# Altium project PCB_Project1.PrjPCB
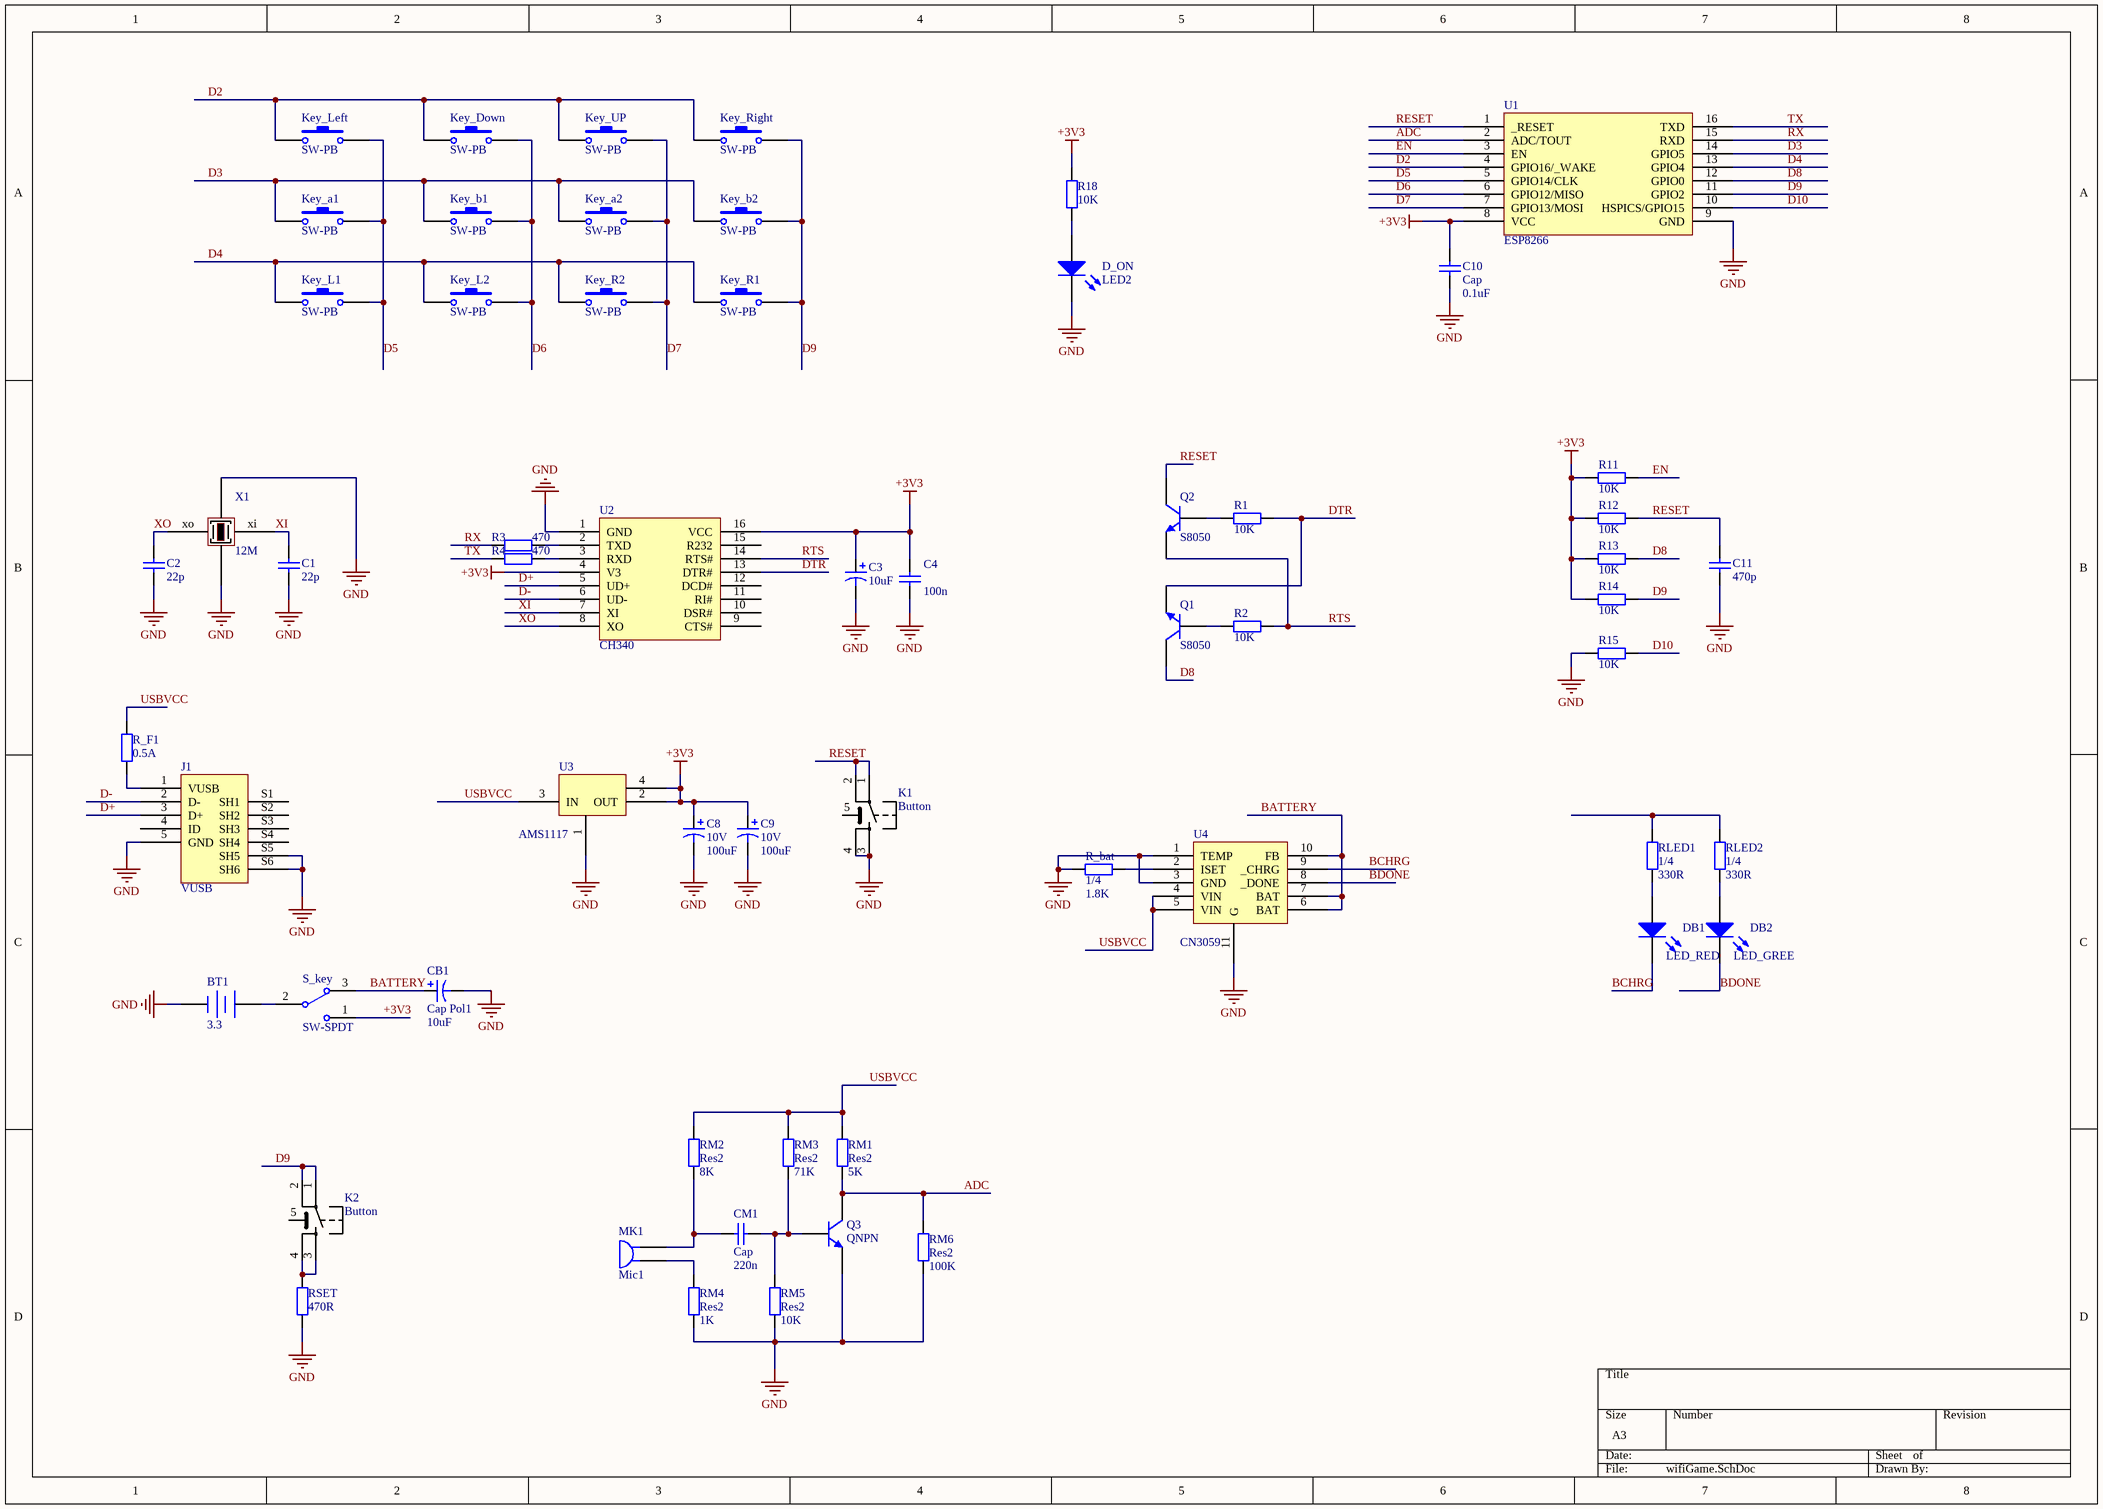
[diagram p0: wifiGame.SchDoc]
4 sheets, 161 parts. Net scope: global (net labels, ports and power ports of the same name join across sheets).
Board files: OneWifiGamePad.PcbDoc, gamePadRL.PcbDoc, gamePadRL2.PcbDoc
Sheets:
  wifiGame.SchDoc
  OneWifiGamePad.SchDoc
  OneWifiGameBAT.SchDoc
  gamePadRL.SchDoc

## Sheet wifiGame.SchDoc
size A3

### Parts
(Parts that share a designator on the sheet are numbered #1, #2 ... from top to bottom, then left to right.)
BT1#1  3.3  [BAT-2]
C1#1  22p  [RAD-0.3]
C2#1  22p  [RAD-0.3]
C3#1  10uF  [RB7.6-15]
C4#1  100n  [RAD-0.3]
C8#1  10V  value 100uF  [RB7.6-15]
C9#1  10V  value 100uF  [RB7.6-15]
C10#1  Cap  value 0.1uF  [RAD-0.3]
C11#1  470p  [RAD-0.3]
CB1#1  Cap Pol1  value 10uF  [RB7.6-15]
CM1  Cap  value 220n  [RAD-0.3]
D_ON#1  LED2  [DSO-F2/D6.1]
DB1#1  LED_RED  [DSO-F2/D6.1]
DB2#1  LED_GREE  [DSO-F2/D6.1]
J1#1  VUSB
K1  Button
K2#1  Button
Key_a1#1  SW-PB  [SPST-2]
Key_a2#1  SW-PB  [SPST-2]
Key_b1#1  SW-PB  [SPST-2]
Key_b2#1  SW-PB  [SPST-2]
Key_Down#1  SW-PB  [SPST-2]
Key_L1#1  SW-PB  [SPST-2]
Key_L2#1  SW-PB  [SPST-2]
Key_Left#1  SW-PB  [SPST-2]
Key_R1#1  SW-PB  [SPST-2]
Key_R2#1  SW-PB  [SPST-2]
Key_Right#1  SW-PB  [SPST-2]
Key_UP#1  SW-PB  [SPST-2]
MK1  Mic1  [PIN2]
Q1#1  S8050  [SOT95P240-3N]
Q2#1  S8050  [SOT95P240-3N]
Q3  QNPN  [SOT95P240-3N]
R1#1  10K  [AXIAL-0.4]
R2#1  10K  [AXIAL-0.4]
R3#1  470  [AXIAL-0.4]
R4#1  470  [AXIAL-0.4]
R11#1  10K  [AXIAL-0.4]
R12#1  10K  [AXIAL-0.4]
R13#1  10K  [AXIAL-0.4]
R14  10K  [AXIAL-0.4]
R15#1  10K  [AXIAL-0.4]
R18#1  10K  [AXIAL-0.4]
R_bat#1  1/4  value 1.8K  [AXIAL-0.4]
R_F1#1  0.5A  [AXIAL-0.4]
RLED1#1  1/4  value 330R  [AXIAL-0.4]
RLED2#1  1/4  value 330R  [AXIAL-0.4]
RM1  Res2  value 5K  [AXIAL-0.4]
RM2  Res2  value 8K  [AXIAL-0.4]
RM3  Res2  value 71K  [AXIAL-0.4]
RM4  Res2  value 1K  [AXIAL-0.4]
RM5  Res2  value 10K  [AXIAL-0.4]
RM6  Res2  value 100K  [AXIAL-0.4]
RSET#1  value 470R  [AXIAL-0.4]  (hidden comment: Res2)
S_key#1  SW-SPDT  [TL36WW15050]
U1#1  ESP8266  [ESP8266MOD?]
U2#1  CH340  [CH340]
U3#1  AMS1117
U4#1  CN3059  [CN3059]
X1#1  12M  [OSO]

### Nets
+3V3: C3#1.1 C4#1.2 C8#1.1 C9#1.1 C10#1.2 R11#1.1 R12#1.1 R13#1.1 R14.1 R18#1.1 S_key#1.1 U1#1.8(VCC) U2#1.4(V3) U2#1.16(VCC) U3#1.2(OUT) U3#1.4(p4)
GND: BT1#1.2(-) C1#1.1 C2#1.1 C3#1.2 C4#1.1 C8#1.2 C9#1.2 C10#1.1 C11#1.1 CB1#1.2 D_ON#1.2(K) J1#1.5(GND) J1#1.S5(SH5) J1#1.S6(SH6) K1.3 K1.4 Q3.3(E) R15#1.1 R_bat#1.2 RM4.1 RM5.1 RM6.1 RSET#1.1 U1#1.9(GND) U2#1.1(GND) U3#1.1(p1) U4#1.1(TEMP) U4#1.3(GND) U4#1.11(G) X1#1.g1(xo) X1#1.g2
ADC: Q3.1(C) RM1.1 RM6.2 U1#1.2(ADC/TOUT)
BATTERY: CB1#1.1 S_key#1.3 U4#1.6(BAT) U4#1.7(BAT) U4#1.10(FB)
BCHRG: DB1#1.2(K) U4#1.9(_CHRG)
BDONE: DB2#1.2(K) U4#1.8(_DONE)
D2: Key_Down#1.1 Key_Left#1.1 Key_Right#1.1 Key_UP#1.1 U1#1.4(GPIO16/_WAKE)
D3: Key_a1#1.1 Key_a2#1.1 Key_b1#1.1 Key_b2#1.1 U1#1.14(GPIO5)
D4: Key_L1#1.1 Key_L2#1.1 Key_R1#1.1 Key_R2#1.1 U1#1.13(GPIO4)
D5: Key_a1#1.2 Key_L1#1.2 Key_Left#1.2 U1#1.5(GPIO14/CLK)
D6: Key_b1#1.2 Key_Down#1.2 Key_L2#1.2 U1#1.6(GPIO12/MISO)
D7: Key_a2#1.2 Key_R2#1.2 Key_UP#1.2 U1#1.7(GPIO13/MOSI)
D8: Q1#1.1(C) R13#1.2 U1#1.12(GPIO0)
D9: K2#1.1 K2#1.2 Key_b2#1.2 Key_R1#1.2 Key_Right#1.2 R14.2 U1#1.11(GPIO2)
D10: R15#1.2 U1#1.10(HSPICS/GPIO15)
D+: J1#1.3(D+) U2#1.5(UD+)
D-: J1#1.2(D-) U2#1.6(UD-)
DTR: Q1#1.3(E) R1#1.2 U2#1.13(DTR#)
EN: R11#1.2 U1#1.3(EN)
RESET: C11#1.2 K1.1 K1.2 Q2#1.1(C) R12#1.2 U1#1.1(_RESET)
RTS: Q2#1.3(E) R2#1.2 U2#1.14(RTS#)
RX: R3#1.1 U1#1.15(RXD)
TX: R4#1.1 U1#1.16(TXD)
USBVCC: R_F1#1.2 RM1.2 RM2.2 RM3.2 U3#1.3(IN) U4#1.4(VIN) U4#1.5(VIN)
XI: C1#1.2 U2#1.7(XI) X1#1.xi(VCC)
XO: C2#1.2 U2#1.8(XO) X1#1.xo(VCC)
NetBT1#1_1: BT1#1.1(+) S_key#1.2
NetCM1_1: CM1.1 MK1.2 RM2.1
NetCM1_2: CM1.2 Q3.2(B) RM3.1 RM5.2
NetD_ON#1_1: D_ON#1.1(A) R18#1.2
NetDB1#1_1: DB1#1.1(A) RLED1#1.1
NetDB2#1_1: DB2#1.1(A) RLED2#1.1
NetJ1#1_1: J1#1.1(VUSB) R_F1#1.1
NetK2#1_3: K2#1.3 K2#1.4 RSET#1.2
NetMK1_1: MK1.1 RM4.2
NetQ1#1_2: Q1#1.2(B) R2#1.1
NetQ2#1_2: Q2#1.2(B) R1#1.1
NetR3#1_2: R3#1.2 U2#1.2(TXD)
NetR4#1_2: R4#1.2 U2#1.3(RXD)
NetR_bat#1_1: R_bat#1.1 U4#1.2(ISET)
NetRLED1#1_2: RLED1#1.2 RLED2#1.2

Not connected (* = marked no-connect by the designer): J1#1 4(ID) S1(SH1) S2(SH2) S3(SH3) S4(SH4); K1 5; K2#1 5; U2#1 9(CTS#) 10(DSR#) 11(RI#) 12(DCD#) 15(R232)

### Library data of the parts
BT1#1 = Battery: Multicell Battery; Published: 24-Mar-1999; LatestRevisionDate: 17-Jul-2002; LatestRevisionNote: Re-released for DXP Platform.; PackageReference: BAT-2; Publisher: Altium Limited
C1#1 C2#1 = Cap: Capacitor; Value: 0.01uF; Published: 8-Jun-2000; LatestRevisionDate: 17-Jul-2002; LatestRevisionNote: Re-released for DXP Platform.; PackageReference: RAD-0.3; Publisher: Altium Limited
C3#1 C8#1 C9#1 CB1#1 = Cap Pol1: Polarized Capacitor (Radial); Published: 8-Jun-2000; LatestRevisionDate: 17-Jul-2002; LatestRevisionNote: Re-released for DXP Platform.; PackageReference: RB7.6-15; Publisher: Altium Limited
  C3#1: Value: 10uF
C4#1 C11#1 = Cap: Capacitor; Value: 0.1uF; Published: 8-Jun-2000; LatestRevisionDate: 17-Jul-2002; LatestRevisionNote: Re-released for DXP Platform.; PackageReference: RAD-0.3; Publisher: Altium Limited
C10#1 CM1 = Cap: Capacitor; Published: 8-Jun-2000; LatestRevisionDate: 17-Jul-2002; LatestRevisionNote: Re-released for DXP Platform.; PackageReference: RAD-0.3; Publisher: Altium Limited
D_ON#1 DB1#1 DB2#1 = LED2: Typical RED, GREEN, YELLOW, AMBER GaAs LED; Published: 8-Jun-2000; LatestRevisionDate: 17-Jul-2002; LatestRevisionNote: Re-released for DXP Platform.; PackageVersion: Feb-2002; PackageReference: 3.2X1.6X1.1; Publisher: Altium Limited
K1 K2#1 = Button: Button key
Key_a1#1 Key_a2#1 Key_b1#1 Key_b2#1 Key_Down#1 Key_L1#1 Key_L2#1 Key_Left#1 Key_R1#1 Key_R2#1 Key_Right#1 Key_UP#1 = SW-PB: Switch; Published: 24-Mar-1999; LatestRevisionDate: 17-Jul-2002; LatestRevisionNote: Re-released for DXP Platform.; PackageReference: SPST-2; Publisher: Altium Limited
MK1 = Mic1: Microphone; Published: 24-Mar-1999; LatestRevisionDate: 17-Jul-2002; LatestRevisionNote: Re-released for DXP Platform.; PackageReference: PIN2; Publisher: Altium Limited
Q1#1 Q2#1 Q3 = QNPN: NPN Bipolar Transistor; Published: 8-Jun-2000; LatestRevisionDate: 29-May-2009; LatestRevisionNote: IPC-7351 Footprint Added.; PackageVersion: Aug-1999; PackageReference: SOT-23B; Publisher: Altium Limited; PackageDescription: 3-Pin SOT-23 Package 0.95 mm Pitch, 2.4 mm Lead Span
R1#1 R2#1 R11#1 R12#1 R13#1 R14 R15#1 R18#1 R_bat#1 RLED1#1 RLED2#1 RM1-RM6 RSET#1 = Res2: Resistor; Published: 8-Jun-2000; LatestRevisionDate: 17-Jul-2002; LatestRevisionNote: Re-released for DXP Platform.; PackageReference: AXIAL-0.4; Publisher: Altium Limited
  R1#1 R2#1 R11#1 R12#1 R13#1 R14 R15#1 R18#1: Value: 10K
R3#1 R4#1 R_F1#1 = Res2: Resistor; Value: 1K; Published: 8-Jun-2000; LatestRevisionDate: 17-Jul-2002; LatestRevisionNote: Re-released for DXP Platform.; PackageReference: AXIAL-0.4; Publisher: Altium Limited
S_key#1 = SW-SPDT: SPDT Subminiature Toggle Switch, Right Angle Mounting, Vertical Actuation; Published: 24-Mar-1999; LatestRevisionDate: 17-Dec-2003; LatestRevisionNote: Schematic revised, PCB Footprint replaced.; DatasheetVersion: 05-Dec-2000; PackageReference: TL36WW15050; Publisher: Altium Limited; ComponentLink1Description: Manufacturer Link; ComponentLink1URL: http://www.apem.com
U1#1 = ESP8266: MCU
U2#1 = RS232
X1#1 = oso

## Sheet OneWifiGamePad.SchDoc
size A4; PageSetup: Record=PageOptions|CenterHorizontal=True|CenterVertical=True|PrintScale=0.71|XCorrection=1.00|YCorrection=1.00|PrintKind=1|BorderSize=5000000|LeftOffset=0|BottomOffset=0|Orientation=2|PaperLength=1000|PaperWidth=1000|Scale=100|PaperSource=15|PrintQuality=600|MediaType=1|DitherType=10|PaperKind=Statement|PrintScaleMode=1
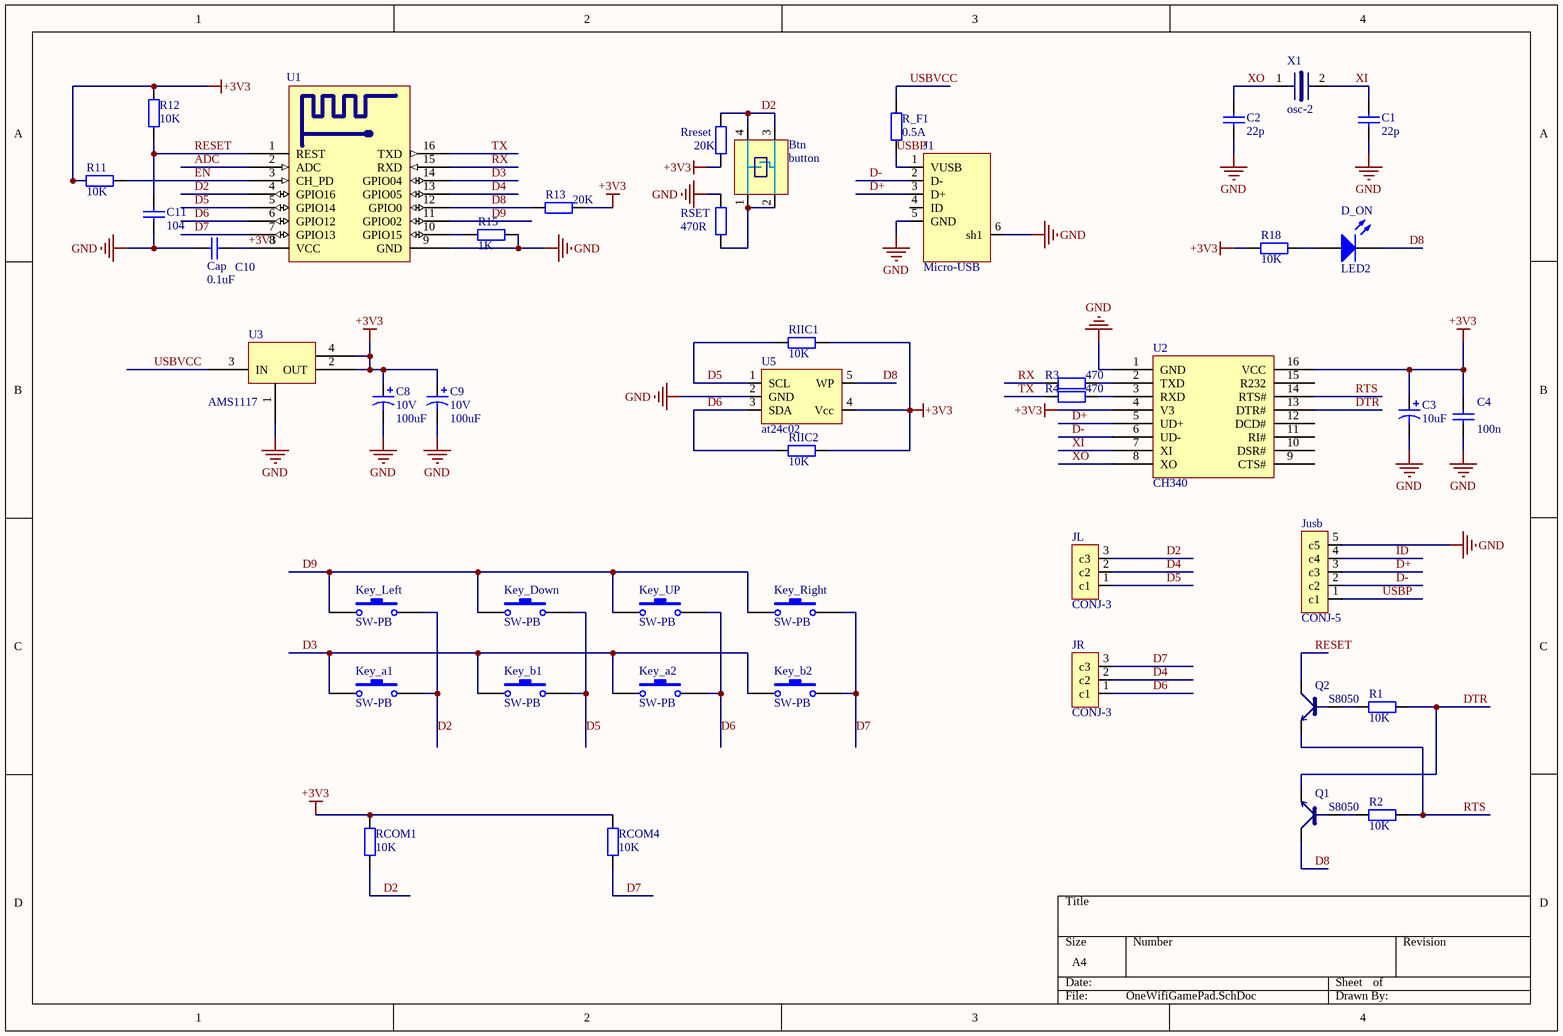
[diagram p1: OneWifiGamePad.SchDoc]

### Parts
(Parts that share a designator on the sheet are numbered #1, #2 ... from top to bottom, then left to right.)
Btn  button  [SW_6x6]
C1#2  22p  [0603]
C2#2  22p  [0603]
C3#2  10uF  [smd-ec-f5]
C4#2  100n  [0603]
C8#2  10V  value 100uF  [smd-ec-f5]
C9#2  10V  value 100uF  [smd-ec-f5]
C10#2  Cap  value 0.1uF  [0603]
C11#2  104  [0603]
D_ON#2  LED2  [0603]
J1#2  Micro-USB  [Micro_USB_B]
JL  CONJ-3  [sip-3]
JR  CONJ-3  [sip-3]
Jusb  CONJ-5  [sip-5]
Key_a1#2  SW-PB  [gamepad]
Key_a2#2  SW-PB  [gamepad]
Key_b1#2  SW-PB  [gamepad]
Key_b2#2  SW-PB  [gamepad]
Key_Down#2  SW-PB  [gamepad]
Key_Left#2  SW-PB  [GamePad]
Key_Right#2  SW-PB  [gamepad]
Key_UP#2  SW-PB  [gamepad]
Q1#2  S8050  [sot23-3]
Q2#2  S8050  [sot23-3]
R1#2  10K  [0603]
R2#2  10K  [0603]
R3#2  470  [0603]
R4#2  470  [0603]
R11#2  10K  [0603]
R12#2  10K  [0603]
R13#2  20K  [0603]
R15#2  1K  [0603]
R18#2  10K  [0603]
R_F1#2  0.5A  [0805]
RCOM1  value 10K  [0603]  (hidden comment: Res2)
RCOM4  value 10K  [0603]  (hidden comment: Res2)
RIIC1#1  10k  [0603]
RIIC2#1  10k  [0603]
Rreset#1  value 20K  [0603]  (hidden comment: 10k)
RSET#2  value 470R  [0603]  (hidden comment: Res2)
U1#2  ESP-12  [ESP_12]  (value not drawn)
U2#2  CH340  [SOP127P762-16M]
U3#2  AMS1117  [SOT-223]
U5#1  at24c02  [sot-23-5]
X1#2  osc-2  [RAD-0.2]

### Nets
+3V3: C3#2.1 C4#2.2 C8#2.1 C9#2.1 C10#2.1 R11#2.1 R12#2.2 R13#2.2 R18#2.1 RCOM1.2 RCOM4.2 RIIC1#1.1 RIIC2#1.1 Rreset#1.1 U1#2.8(VCC) U2#2.4(V3) U2#2.16(VCC) U3#2.2(OUT) U3#2.4(p4) U5#1.4(Vcc)
GND: C1#2.1 C2#2.1 C3#2.2 C4#2.1 C8#2.2 C9#2.2 C10#2.2 C11#2.1 J1#2.5(GND) J1#2.6(sh1) Jusb.5(c5) R15#2.2 RSET#2.2 U1#2.9(GND) U2#2.1(GND) U3#2.1(p1) U5#1.2(GND)
ADC: U1#2.2(ADC)
D2: Btn.3(b2) Btn.4(a2) JL.3(c3) Key_a1#2.2 Key_Left#2.2 RCOM1.1 Rreset#1.2 U1#2.4(GPIO16)
D3: Key_a1#2.1 Key_a2#2.1 Key_b1#2.1 Key_b2#2.1 U1#2.14(GPIO04)
D4: JL.2(c2) JR.2(c2) U1#2.13(GPIO05)
D5: JL.1(c1) Key_b1#2.2 Key_Down#2.2 RIIC1#1.2 U1#2.5(GPIO14) U5#1.1(SCL)
D6: JR.1(c1) Key_a2#2.2 Key_UP#2.2 RIIC2#1.2 U1#2.6(GPIO12) U5#1.3(SDA)
D7: JR.3(c3) Key_b2#2.2 Key_Right#2.2 RCOM4.1 U1#2.7(GPIO13)
D8: D_ON#2.2(K) Q1#2.3 R13#2.1 U1#2.12(GPIO0) U5#1.5(WP)
D9: Key_Down#2.1 Key_Left#2.1 Key_Right#2.1 Key_UP#2.1 U1#2.11(GPIO02)
D+: J1#2.3(D+) Jusb.3(c3) U2#2.5(UD+)
D-: J1#2.2(D-) Jusb.2(c2) U2#2.6(UD-)
DTR: Q1#2.2 R1#2.2 U2#2.13(DTR#)
EN: R11#2.2 U1#2.3(CH_PD)
ID: Jusb.4(c4)
RESET: C11#2.2 Q2#2.3 R12#2.1 U1#2.1(REST)
RTS: Q2#2.2 R2#2.2 U2#2.14(RTS#)
RX: R3#2.1 U1#2.15(RXD)
TX: R4#2.1 U1#2.16(TXD)
USBP: J1#2.1(VUSB) Jusb.1(c1) R_F1#2.1
USBVCC: R_F1#2.2 U3#2.3(IN)
XI: C1#2.2 U2#2.7(XI) X1#2.2(c7)
XO: C2#2.2 U2#2.8(XO) X1#2.1(c6)
NetBtn_1: Btn.1(a1) Btn.2(b1) RSET#2.1
NetD_ON#2_1: D_ON#2.1(A) R18#2.2
NetQ1#2_1: Q1#2.1 R2#2.1
NetQ2#2_1: Q2#2.1 R1#2.1
NetR3#2_2: R3#2.2 U2#2.2(TXD)
NetR4#2_2: R4#2.2 U2#2.3(RXD)
NetR15#2_1: R15#2.1 U1#2.10(GPIO15)

Not connected (* = marked no-connect by the designer): J1#2 4(ID); U2#2 9(CTS#) 10(DSR#) 11(RI#) 12(DCD#) 15(R232)

### Library data of the parts
C1#2 C2#2 = Cap: Capacitor; Value: 0.01uF; Published: 8-Jun-2000; LatestRevisionDate: 17-Jul-2002; LatestRevisionNote: Re-released for DXP Platform.; PackageReference: RAD-0.3; Publisher: Altium Limited
C3#2 C8#2 C9#2 = Cap Pol1: Polarized Capacitor (Radial); Published: 8-Jun-2000; LatestRevisionDate: 17-Jul-2002; LatestRevisionNote: Re-released for DXP Platform.; PackageReference: RB7.6-15; Publisher: Altium Limited
  C3#2: Value: 10uF
C4#2 C11#2 = Cap: Capacitor; Value: 0.1uF; Published: 8-Jun-2000; LatestRevisionDate: 17-Jul-2002; LatestRevisionNote: Re-released for DXP Platform.; PackageReference: RAD-0.3; Publisher: Altium Limited
C10#2 = Cap: Capacitor; Published: 8-Jun-2000; LatestRevisionDate: 17-Jul-2002; LatestRevisionNote: Re-released for DXP Platform.; PackageReference: RAD-0.3; Publisher: Altium Limited
D_ON#2 = LED2: as D_ON#1 on sheet wifiGame; Published: 8-Jun-2000; LatestRevisionDate: 17-Jul-2002; LatestRevisionNote: Re-released for DXP Platform.; PackageVersion: Feb-2002; PackageReference: 3.2X1.6X1.1; Publisher: Altium Limited
Key_a1#2 Key_a2#2 Key_b1#2 Key_b2#2 Key_Down#2 Key_Left#2 Key_Right#2 Key_UP#2 = SW-PB: Switch; Published: 24-Mar-1999; LatestRevisionDate: 17-Jul-2002; LatestRevisionNote: Re-released for DXP Platform.; PackageReference: SPST-2; Publisher: Altium Limited
Q1#2 Q2#2 = NPN_23-3
R1#2 R2#2 R11#2 R12#2 R18#2 RCOM1 RCOM4 RIIC1#1 RIIC2#1 Rreset#1 RSET#2 = Res2: Resistor; Published: 8-Jun-2000; LatestRevisionDate: 17-Jul-2002; LatestRevisionNote: Re-released for DXP Platform.; PackageReference: AXIAL-0.4; Publisher: Altium Limited
  R1#2 R2#2 R11#2 R12#2 R18#2 RIIC1#1 RIIC2#1: Value: 10K
R3#2 R4#2 R_F1#2 = Res2: Resistor; Value: 1K; Published: 8-Jun-2000; LatestRevisionDate: 17-Jul-2002; LatestRevisionNote: Re-released for DXP Platform.; PackageReference: AXIAL-0.4; Publisher: Altium Limited
R13#2 R15#2 = Res2: Resistor; Value: 10K; Published: 8-Jun-2000; LatestRevisionDate: 17-Jul-2002; LatestRevisionNote: Re-released for DXP Platform.; PackageReference: AXIAL-0.4; Publisher: Altium Limited
U2#2 = RS232

## Sheet OneWifiGameBAT.SchDoc
size A3
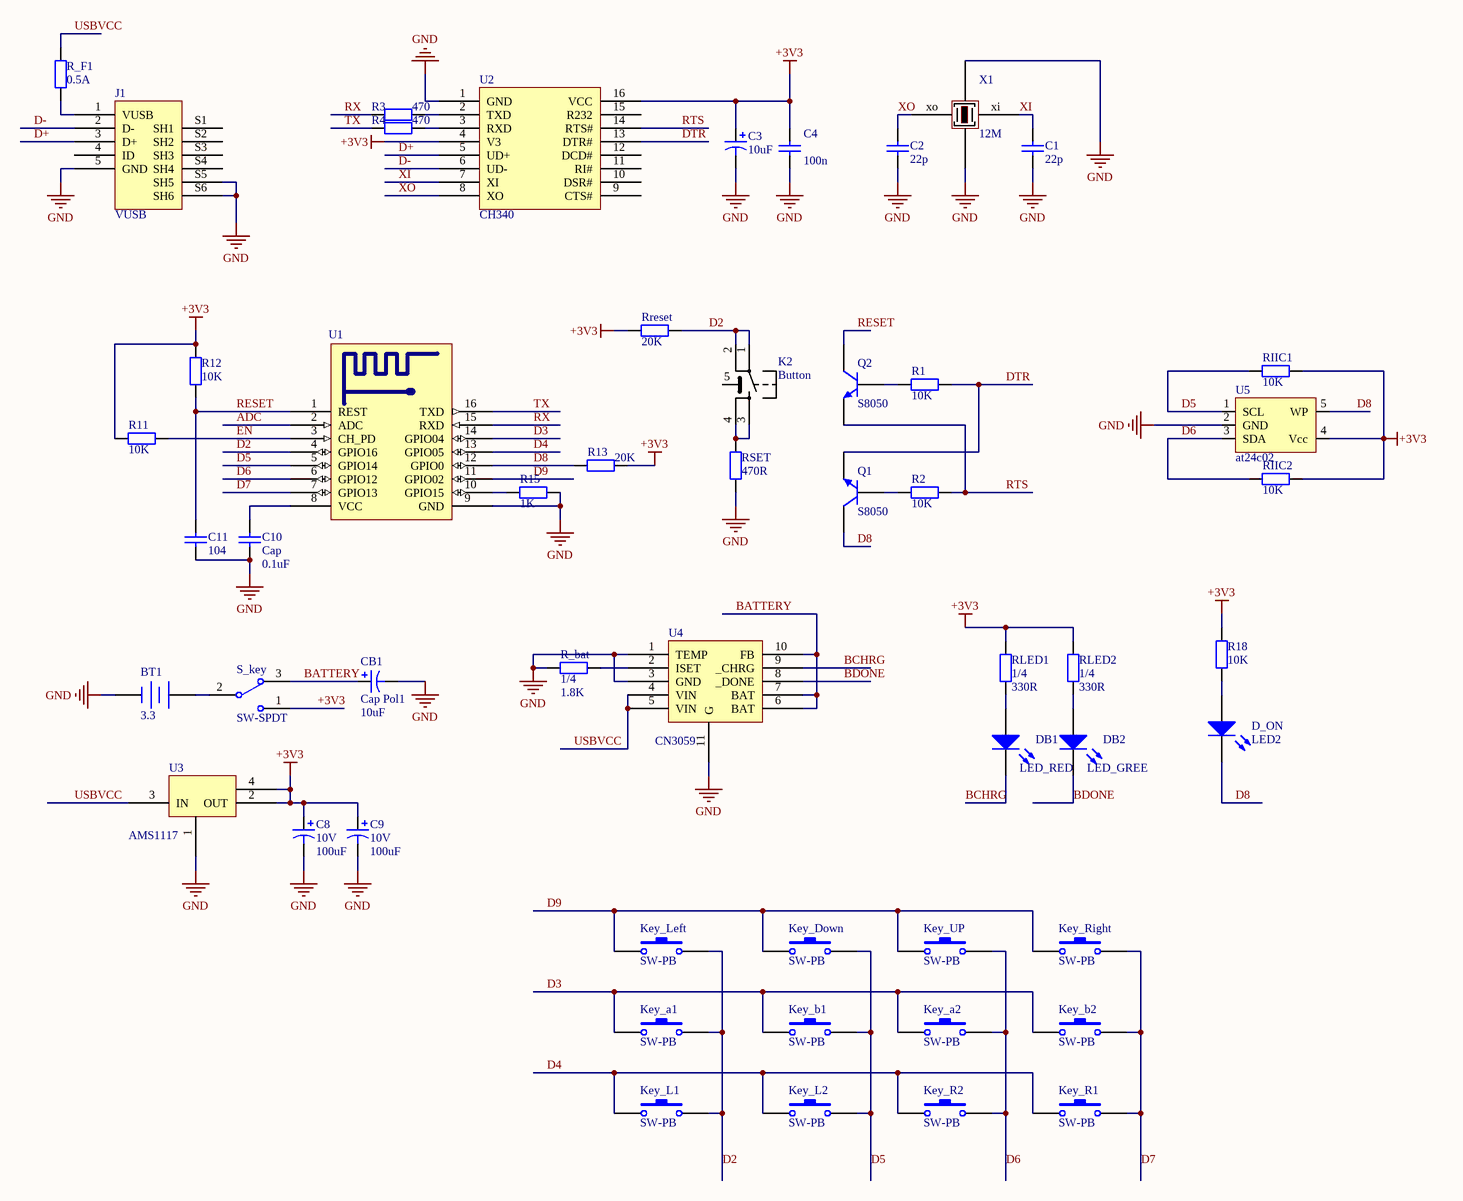
[diagram p2: OneWifiGameBAT.SchDoc]

### Parts
(Parts that share a designator on the sheet are numbered #1, #2 ... from top to bottom, then left to right.)
BT1#2  3.3  [BAT-2]
C1#3  22p  [RAD-0.3]
C2#3  22p  [RAD-0.3]
C3#3  10uF  [RB7.6-15]
C4#3  100n  [RAD-0.3]
C8#3  10V  value 100uF  [RB7.6-15]
C9#3  10V  value 100uF  [RB7.6-15]
C10#3  Cap  value 0.1uF  [RAD-0.3]
C11#3  104  [RAD-0.3]
CB1#2  Cap Pol1  value 10uF  [RB7.6-15]
D_ON#3  LED2  [DSO-F2/D6.1]
DB1#2  LED_RED  [DSO-F2/D6.1]
DB2#2  LED_GREE  [DSO-F2/D6.1]
J1#3  VUSB
K2#2  Button
Key_a1#3  SW-PB  [SPST-2]
Key_a2#3  SW-PB  [SPST-2]
Key_b1#3  SW-PB  [SPST-2]
Key_b2#3  SW-PB  [SPST-2]
Key_Down#3  SW-PB  [SPST-2]
Key_L1#2  SW-PB  [SPST-2]
Key_L2#2  SW-PB  [SPST-2]
Key_Left#3  SW-PB  [SPST-2]
Key_R1#2  SW-PB  [SPST-2]
Key_R2#2  SW-PB  [SPST-2]
Key_Right#3  SW-PB  [SPST-2]
Key_UP#3  SW-PB  [SPST-2]
Q1#3  S8050  [SOT95P240-3N]
Q2#3  S8050  [SOT95P240-3N]
R1#3  10K  [AXIAL-0.4]
R2#3  10K  [AXIAL-0.4]
R3#3  470  [AXIAL-0.4]
R4#3  470  [AXIAL-0.4]
R11#3  10K  [AXIAL-0.4]
R12#3  10K  [AXIAL-0.4]
R13#3  20K  [AXIAL-0.4]
R15#3  1K  [AXIAL-0.4]
R18#3  10K  [AXIAL-0.4]
R_bat#2  1/4  value 1.8K  [AXIAL-0.4]
R_F1#3  0.5A  [AXIAL-0.4]
RIIC1#2  10k  [AXIAL-0.4]
RIIC2#2  10k  [AXIAL-0.4]
RLED1#2  1/4  value 330R  [AXIAL-0.4]
RLED2#2  1/4  value 330R  [AXIAL-0.4]
Rreset#2  value 20K  [AXIAL-0.4]  (hidden comment: 10k)
RSET#3  value 470R  [AXIAL-0.4]  (hidden comment: Res2)
S_key#2  SW-SPDT  [TL36WW15050]
U1#3  ESP-12  (value not drawn)
U2#3  CH340  [CH340]
U3#3  AMS1117
U4#2  CN3059  [CN3059]
U5#2  at24c02
X1#3  12M  [OSO]

### Nets
+3V3: C3#3.1 C4#3.2 C8#3.1 C9#3.1 R11#3.1 R12#3.2 R13#3.2 R18#3.1 RIIC1#2.1 RIIC2#2.1 RLED1#2.2 RLED2#2.2 Rreset#2.1 S_key#2.1 U2#3.4(V3) U2#3.16(VCC) U3#3.2(OUT) U3#3.4(p4) U5#2.4(Vcc)
GND: BT1#2.2(-) C1#3.1 C2#3.1 C3#3.2 C4#3.1 C8#3.2 C9#3.2 C10#3.1 C11#3.1 CB1#2.2 J1#3.5(GND) J1#3.S5(SH5) J1#3.S6(SH6) R15#3.2 R_bat#2.2 RSET#3.1 U1#3.9(GND) U2#3.1(GND) U3#3.1(p1) U4#2.1(TEMP) U4#2.3(GND) U4#2.11(G) U5#2.2(GND) X1#3.g1(xo) X1#3.g2
ADC: U1#3.2(ADC)
BATTERY: CB1#2.1 S_key#2.3 U4#2.6(BAT) U4#2.7(BAT) U4#2.10(FB)
BCHRG: DB1#2.2(K) U4#2.9(_CHRG)
BDONE: DB2#2.2(K) U4#2.8(_DONE)
D2: K2#2.1 K2#2.2 Key_a1#3.2 Key_L1#2.2 Key_Left#3.2 Rreset#2.2 U1#3.4(GPIO16)
D3: Key_a1#3.1 Key_a2#3.1 Key_b1#3.1 Key_b2#3.1 U1#3.14(GPIO04)
D4: Key_L1#2.1 Key_L2#2.1 Key_R1#2.1 Key_R2#2.1 U1#3.13(GPIO05)
D5: Key_b1#3.2 Key_Down#3.2 Key_L2#2.2 RIIC1#2.2 U1#3.5(GPIO14) U5#2.1(SCL)
D6: Key_a2#3.2 Key_R2#2.2 Key_UP#3.2 RIIC2#2.2 U1#3.6(GPIO12) U5#2.3(SDA)
D7: Key_b2#3.2 Key_R1#2.2 Key_Right#3.2 U1#3.7(GPIO13)
D8: D_ON#3.2(K) Q1#3.1(C) R13#3.1 U1#3.12(GPIO0) U5#2.5(WP)
D9: Key_Down#3.1 Key_Left#3.1 Key_Right#3.1 Key_UP#3.1 U1#3.11(GPIO02)
D+: J1#3.3(D+) U2#3.5(UD+)
D-: J1#3.2(D-) U2#3.6(UD-)
DTR: Q1#3.3(E) R1#3.2 U2#3.13(DTR#)
EN: R11#3.2 U1#3.3(CH_PD)
RESET: C11#3.2 Q2#3.1(C) R12#3.1 U1#3.1(REST)
RTS: Q2#3.3(E) R2#3.2 U2#3.14(RTS#)
RX: R3#3.1 U1#3.15(RXD)
TX: R4#3.1 U1#3.16(TXD)
USBVCC: R_F1#3.2 U3#3.3(IN) U4#2.4(VIN) U4#2.5(VIN)
XI: C1#3.2 U2#3.7(XI) X1#3.xi(VCC)
XO: C2#3.2 U2#3.8(XO) X1#3.xo(VCC)
NetBT1#2_1: BT1#2.1(+) S_key#2.2
NetC10#3_2: C10#3.2 U1#3.8(VCC)
NetD_ON#3_1: D_ON#3.1(A) R18#3.2
NetDB1#2_1: DB1#2.1(A) RLED1#2.1
NetDB2#2_1: DB2#2.1(A) RLED2#2.1
NetJ1#3_1: J1#3.1(VUSB) R_F1#3.1
NetK2#2_3: K2#2.3 K2#2.4 RSET#3.2
NetQ1#3_2: Q1#3.2(B) R2#3.1
NetQ2#3_2: Q2#3.2(B) R1#3.1
NetR3#3_2: R3#3.2 U2#3.2(TXD)
NetR4#3_2: R4#3.2 U2#3.3(RXD)
NetR15#3_1: R15#3.1 U1#3.10(GPIO15)
NetR_bat#2_1: R_bat#2.1 U4#2.2(ISET)

Not connected (* = marked no-connect by the designer): J1#3 4(ID) S1(SH1) S2(SH2) S3(SH3) S4(SH4); K2#2 5; U2#3 9(CTS#) 10(DSR#) 11(RI#) 12(DCD#) 15(R232)

### Library data of the parts
BT1#2 = Battery: Multicell Battery; Published: 24-Mar-1999; LatestRevisionDate: 17-Jul-2002; LatestRevisionNote: Re-released for DXP Platform.; PackageReference: BAT-2; Publisher: Altium Limited
C1#3 C2#3 = Cap: Capacitor; Value: 0.01uF; Published: 8-Jun-2000; LatestRevisionDate: 17-Jul-2002; LatestRevisionNote: Re-released for DXP Platform.; PackageReference: RAD-0.3; Publisher: Altium Limited
C3#3 C8#3 C9#3 CB1#2 = Cap Pol1: Polarized Capacitor (Radial); Published: 8-Jun-2000; LatestRevisionDate: 17-Jul-2002; LatestRevisionNote: Re-released for DXP Platform.; PackageReference: RB7.6-15; Publisher: Altium Limited
  C3#3: Value: 10uF
C4#3 C11#3 = Cap: Capacitor; Value: 0.1uF; Published: 8-Jun-2000; LatestRevisionDate: 17-Jul-2002; LatestRevisionNote: Re-released for DXP Platform.; PackageReference: RAD-0.3; Publisher: Altium Limited
C10#3 = Cap: Capacitor; Published: 8-Jun-2000; LatestRevisionDate: 17-Jul-2002; LatestRevisionNote: Re-released for DXP Platform.; PackageReference: RAD-0.3; Publisher: Altium Limited
D_ON#3 DB1#2 DB2#2 = LED2: as D_ON#1 on sheet wifiGame; Published: 8-Jun-2000; LatestRevisionDate: 17-Jul-2002; LatestRevisionNote: Re-released for DXP Platform.; PackageVersion: Feb-2002; PackageReference: 3.2X1.6X1.1; Publisher: Altium Limited
K2#2 = Button: Button key
Key_a1#3 Key_a2#3 Key_b1#3 Key_b2#3 Key_Down#3 Key_L1#2 Key_L2#2 Key_Left#3 Key_R1#2 Key_R2#2 Key_Right#3 Key_UP#3 = SW-PB: Switch; Published: 24-Mar-1999; LatestRevisionDate: 17-Jul-2002; LatestRevisionNote: Re-released for DXP Platform.; PackageReference: SPST-2; Publisher: Altium Limited
Q1#3 Q2#3 = QNPN: NPN Bipolar Transistor; Published: 8-Jun-2000; LatestRevisionDate: 29-May-2009; LatestRevisionNote: IPC-7351 Footprint Added.; PackageVersion: Aug-1999; PackageReference: SOT-23B; Publisher: Altium Limited; PackageDescription: 3-Pin SOT-23 Package 0.95 mm Pitch, 2.4 mm Lead Span
R1#3 R2#3 R11#3 R12#3 R18#3 R_bat#2 RIIC1#2 RIIC2#2 RLED1#2 RLED2#2 Rreset#2 RSET#3 = Res2: Resistor; Published: 8-Jun-2000; LatestRevisionDate: 17-Jul-2002; LatestRevisionNote: Re-released for DXP Platform.; PackageReference: AXIAL-0.4; Publisher: Altium Limited
  R1#3 R2#3 R11#3 R12#3 R18#3 RIIC1#2 RIIC2#2: Value: 10K
R3#3 R4#3 R_F1#3 = Res2: Resistor; Value: 1K; Published: 8-Jun-2000; LatestRevisionDate: 17-Jul-2002; LatestRevisionNote: Re-released for DXP Platform.; PackageReference: AXIAL-0.4; Publisher: Altium Limited
R13#3 R15#3 = Res2: Resistor; Value: 10K; Published: 8-Jun-2000; LatestRevisionDate: 17-Jul-2002; LatestRevisionNote: Re-released for DXP Platform.; PackageReference: AXIAL-0.4; Publisher: Altium Limited
S_key#2 = SW-SPDT: as S_key#1 on sheet wifiGame; Published: 24-Mar-1999; LatestRevisionDate: 17-Dec-2003; LatestRevisionNote: Schematic revised, PCB Footprint replaced.; DatasheetVersion: 05-Dec-2000; PackageReference: TL36WW15050; Publisher: Altium Limited; ComponentLink1Description: Manufacturer Link; ComponentLink1URL: http://www.apem.com
U2#3 = RS232
X1#3 = oso

## Sheet gamePadRL.SchDoc
size A4
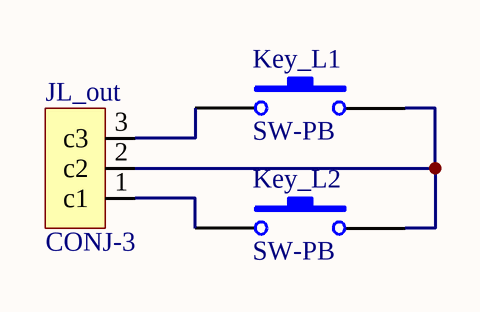
[diagram p3: gamePadRL.SchDoc]

### Parts
(Parts that share a designator on the sheet are numbered #1, #2 ... from top to bottom, then left to right.)
JL_out  CONJ-3  [sip-3]
Key_L1#3  SW-PB  [gamepadbig]
Key_L2#3  SW-PB  [gamepadbig]

### Nets
NetJL_out_1: JL_out.1(c1) Key_L2#3.1
NetJL_out_2: JL_out.2(c2) Key_L1#3.2 Key_L2#3.2
NetJL_out_3: JL_out.3(c3) Key_L1#3.1

### Library data of the parts
Key_L1#3 Key_L2#3 = SW-PB: Switch; Published: 24-Mar-1999; LatestRevisionDate: 17-Jul-2002; LatestRevisionNote: Re-released for DXP Platform.; PackageReference: SPST-2; Publisher: Altium Limited

## Nets that join several sheets
+3V3: wifiGame (16 pins), OneWifiGamePad (20 pins), OneWifiGameBAT (19 pins)
GND: wifiGame (31 pins), OneWifiGamePad (17 pins), OneWifiGameBAT (25 pins)
ADC: wifiGame (Q3.1 RM1.1 RM6.2 U1#1.2), OneWifiGamePad (U1#2.2), OneWifiGameBAT (U1#3.2)
BATTERY: wifiGame (5 pins), OneWifiGameBAT (5 pins)
BCHRG: wifiGame (DB1#1.2 U4#1.9), OneWifiGameBAT (DB1#2.2 U4#2.9)
BDONE: wifiGame (DB2#1.2 U4#1.8), OneWifiGameBAT (DB2#2.2 U4#2.8)
D2: wifiGame (5 pins), OneWifiGamePad (8 pins), OneWifiGameBAT (7 pins)
D3: wifiGame (5 pins), OneWifiGamePad (5 pins), OneWifiGameBAT (5 pins)
D4: wifiGame (5 pins), OneWifiGamePad (JL.2 JR.2 U1#2.13), OneWifiGameBAT (5 pins)
D5: wifiGame (Key_a1#1.2 Key_L1#1.2 Key_Left#1.2 U1#1.5), OneWifiGamePad (6 pins), OneWifiGameBAT (6 pins)
D6: wifiGame (Key_b1#1.2 Key_Down#1.2 Key_L2#1.2 U1#1.6), OneWifiGamePad (6 pins), OneWifiGameBAT (6 pins)
D7: wifiGame (Key_a2#1.2 Key_R2#1.2 Key_UP#1.2 U1#1.7), OneWifiGamePad (5 pins), OneWifiGameBAT (Key_b2#3.2 Key_R1#2.2 Key_Right#3.2 U1#3.7)
D8: wifiGame (Q1#1.1 R13#1.2 U1#1.12), OneWifiGamePad (5 pins), OneWifiGameBAT (5 pins)
D9: wifiGame (7 pins), OneWifiGamePad (5 pins), OneWifiGameBAT (5 pins)
D+: wifiGame (J1#1.3 U2#1.5), OneWifiGamePad (J1#2.3 Jusb.3 U2#2.5), OneWifiGameBAT (J1#3.3 U2#3.5)
D-: wifiGame (J1#1.2 U2#1.6), OneWifiGamePad (J1#2.2 Jusb.2 U2#2.6), OneWifiGameBAT (J1#3.2 U2#3.6)
DTR: wifiGame (Q1#1.3 R1#1.2 U2#1.13), OneWifiGamePad (Q1#2.2 R1#2.2 U2#2.13), OneWifiGameBAT (Q1#3.3 R1#3.2 U2#3.13)
EN: wifiGame (R11#1.2 U1#1.3), OneWifiGamePad (R11#2.2 U1#2.3), OneWifiGameBAT (R11#3.2 U1#3.3)
RESET: wifiGame (6 pins), OneWifiGamePad (C11#2.2 Q2#2.3 R12#2.1 U1#2.1), OneWifiGameBAT (C11#3.2 Q2#3.1 R12#3.1 U1#3.1)
RTS: wifiGame (Q2#1.3 R2#1.2 U2#1.14), OneWifiGamePad (Q2#2.2 R2#2.2 U2#2.14), OneWifiGameBAT (Q2#3.3 R2#3.2 U2#3.14)
RX: wifiGame (R3#1.1 U1#1.15), OneWifiGamePad (R3#2.1 U1#2.15), OneWifiGameBAT (R3#3.1 U1#3.15)
TX: wifiGame (R4#1.1 U1#1.16), OneWifiGamePad (R4#2.1 U1#2.16), OneWifiGameBAT (R4#3.1 U1#3.16)
USBVCC: wifiGame (7 pins), OneWifiGamePad (R_F1#2.2 U3#2.3), OneWifiGameBAT (R_F1#3.2 U3#3.3 U4#2.4 U4#2.5)
XI: wifiGame (C1#1.2 U2#1.7 X1#1.xi), OneWifiGamePad (C1#2.2 U2#2.7 X1#2.2), OneWifiGameBAT (C1#3.2 U2#3.7 X1#3.xi)
XO: wifiGame (C2#1.2 U2#1.8 X1#1.xo), OneWifiGamePad (C2#2.2 U2#2.8 X1#2.1), OneWifiGameBAT (C2#3.2 U2#3.8 X1#3.xo)